# EAGLE schematic motorController-merged (EAGLE 9.3.0)

## Sheet 1 of 3
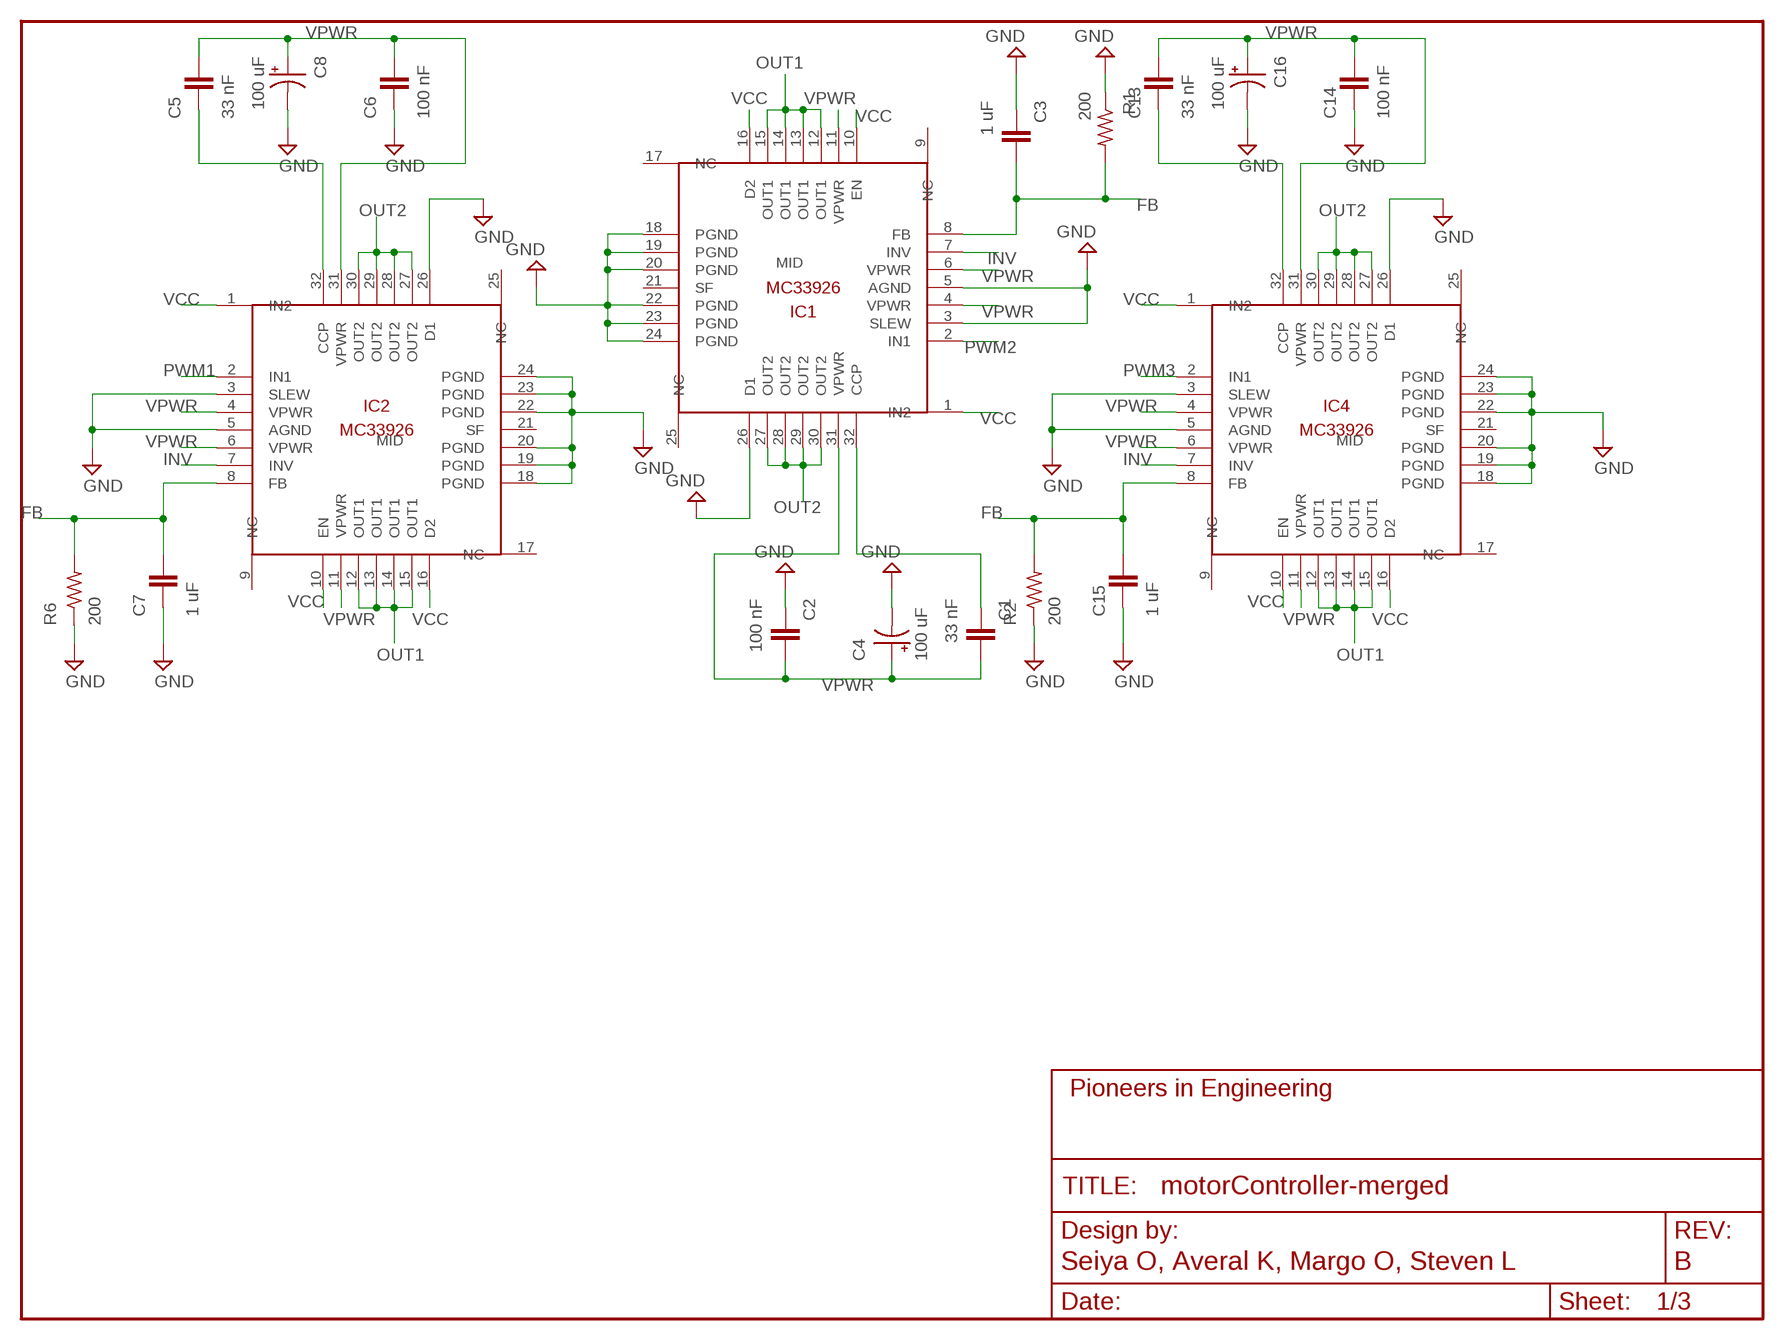
[diagram p0: schematic, sheet 1]
FRAME2 (FRAME_SCHEMATIC): AUTHOR: Seiya O, Averal K, Margo O, Steven L; REVISION: B

### Parts
C1  33 nF  CAP0603-CAP  [0603-CAP]
C2  100 nF  CAP0603-CAP  [0603-CAP]
C3  1 uF  CAP0603-CAP  [0603-CAP]
C4  100 uF  CAP_POLRADIAL  [.248"CAP_THRU]
C5  33 nF  CAP0603-CAP  [0603-CAP]
C6  100 nF  CAP0603-CAP  [0603-CAP]
C7  1 uF  CAP0603-CAP  [0603-CAP]
C8  100 uF  CAP_POLRADIAL  [.248"CAP_THRU]
C13  33 nF  CAP0603-CAP  [0603-CAP]
C14  100 nF  CAP0603-CAP  [0603-CAP]
C15  1 uF  CAP0603-CAP  [0603-CAP]
C16  100 uF  CAP_POLRADIAL  [.248"CAP_THRU]
IC1  MC33926  [PQFN-32]
IC2  MC33926  [PQFN-32]
IC4  MC33926  [PQFN-32]
R1  200  R-US_R0603  [R0603]
R2  200  R-US_R0603  [R0603]
R6  200  R-US_R0603  [R0603]

### Nets
CCP1: C5.1 IC2.32(CCP)
CCP3: C1.1 IC1.32(CCP)
CCP4: C13.1 IC4.32(CCP)
FB: C3.2 C7.2 C15.2 IC1.8(FB) IC2.8(FB) IC4.8(FB) R1.2 R2.2 R6.2 ; also sheet 2,3
GND: C2.1 C3.1 C4.MINUS(-) C6.1 C7.1 C8.MINUS(-) C14.1 C15.1 C16.MINUS(-) IC1.3(SLEW) IC1.5(AGND) IC1.18(PGND) IC1.19(PGND) IC1.20(PGND) IC1.22(PGND) IC1.23(PGND) IC1.24(PGND) IC1.26(D1) IC2.3(SLEW) IC2.5(AGND) IC2.18(PGND) IC2.19(PGND) IC2.20(PGND) IC2.22(PGND) IC2.23(PGND) IC2.24(PGND) IC2.26(D1) IC4.3(SLEW) IC4.5(AGND) IC4.18(PGND) IC4.19(PGND) IC4.20(PGND) IC4.22(PGND) IC4.23(PGND) IC4.24(PGND) IC4.26(D1) R1.1 R2.1 R6.1 ; also sheet 2,3
INV: IC1.7(INV) IC2.7(INV) IC4.7(INV) ; also sheet 2,3
OUT1: IC1.12(OUT1) IC1.13(OUT1) IC1.14(OUT1) IC1.15(OUT1) IC2.12(OUT1) IC2.13(OUT1) IC2.14(OUT1) IC2.15(OUT1) IC4.12(OUT1) IC4.13(OUT1) IC4.14(OUT1) IC4.15(OUT1) ; also sheet 2,3
OUT2: IC1.27(OUT2) IC1.28(OUT2) IC1.29(OUT2) IC1.30(OUT2) IC2.27(OUT2) IC2.28(OUT2) IC2.29(OUT2) IC2.30(OUT2) IC4.27(OUT2) IC4.28(OUT2) IC4.29(OUT2) IC4.30(OUT2) ; also sheet 2,3
PWM1: IC2.2(IN1) ; also sheet 3
PWM2: IC1.2(IN1) ; also sheet 3
PWM3: IC4.2(IN1) ; also sheet 3
VCC: IC1.1(IN2) IC1.10(EN) IC1.16(D2) IC2.1(IN2) IC2.10(EN) IC2.16(D2) IC4.1(IN2) IC4.10(EN) IC4.16(D2) ; also sheet 2,3
VPWR: C1.2 C2.2 C4.PLUS(+) C5.2 C6.2 C8.PLUS(+) C13.2 C14.2 C16.PLUS(+) IC1.4(VPWR) IC1.6(VPWR) IC1.11(VPWR) IC1.31(VPWR) IC2.4(VPWR) IC2.6(VPWR) IC2.11(VPWR) IC2.31(VPWR) IC4.4(VPWR) IC4.6(VPWR) IC4.11(VPWR) IC4.31(VPWR) ; also sheet 2,3
Unconnected: IC1.9(NC) IC1.17(NC) IC1.21(SF) IC1.25(NC) IC1.MID(AGND) IC2.9(NC) IC2.17(NC) IC2.21(SF) IC2.25(NC) IC2.MID(AGND) IC4.9(NC) IC4.17(NC) IC4.21(SF) IC4.25(NC) IC4.MID(AGND)

## Sheet 2 of 3
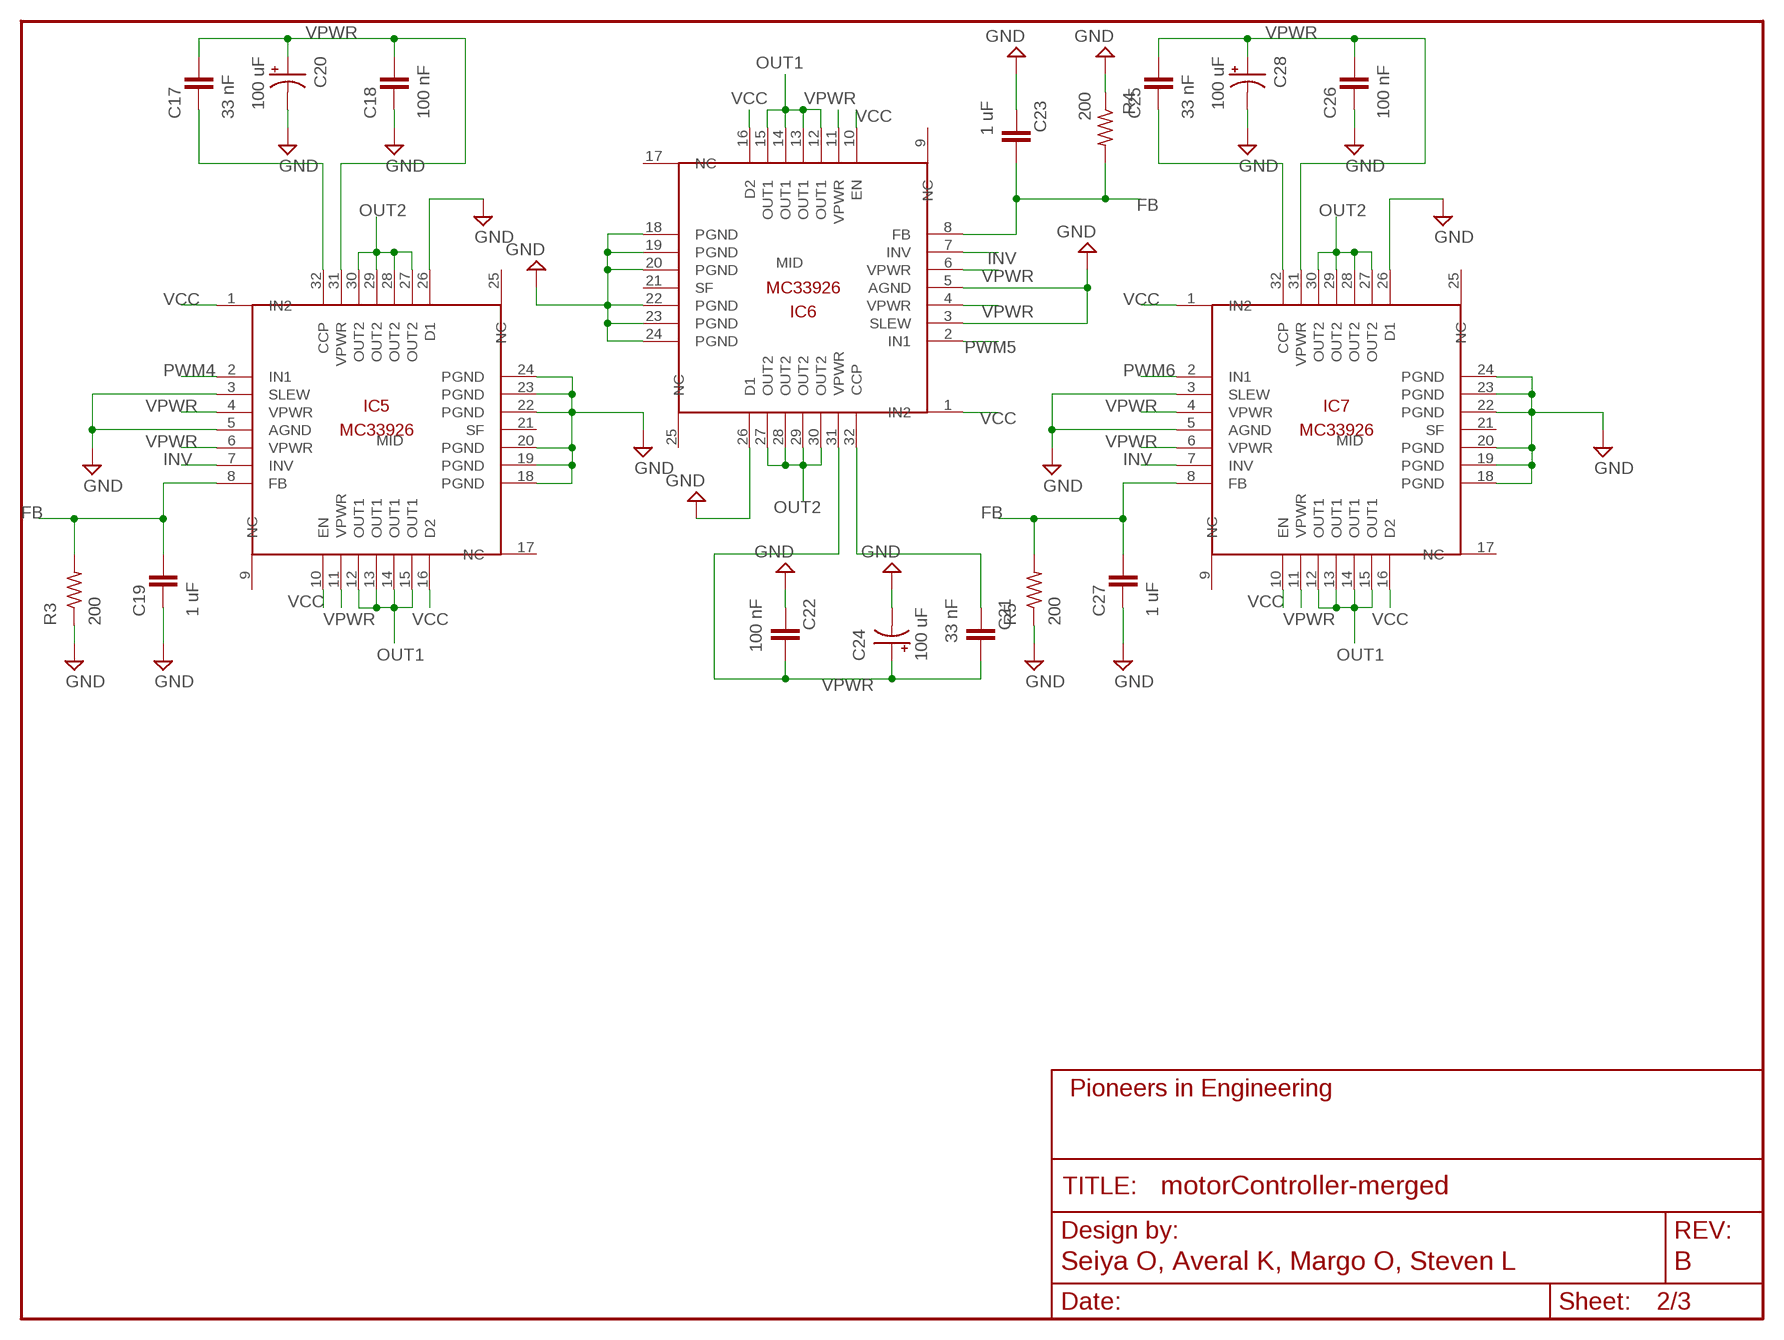
[diagram p1: schematic, sheet 2]
FRAME1 (FRAME_SCHEMATIC): AUTHOR: Seiya O, Averal K, Margo O, Steven L; REVISION: B

### Parts
C17  33 nF  CAP0603-CAP  [0603-CAP]
C18  100 nF  CAP0603-CAP  [0603-CAP]
C19  1 uF  CAP0603-CAP  [0603-CAP]
C20  100 uF  CAP_POLRADIAL  [.248"CAP_THRU]
C21  33 nF  CAP0603-CAP  [0603-CAP]
C22  100 nF  CAP0603-CAP  [0603-CAP]
C23  1 uF  CAP0603-CAP  [0603-CAP]
C24  100 uF  CAP_POLRADIAL  [.248"CAP_THRU]
C25  33 nF  CAP0603-CAP  [0603-CAP]
C26  100 nF  CAP0603-CAP  [0603-CAP]
C27  1 uF  CAP0603-CAP  [0603-CAP]
C28  100 uF  CAP_POLRADIAL  [.248"CAP_THRU]
IC5  MC33926  [PQFN-32]
IC6  MC33926  [PQFN-32]
IC7  MC33926  [PQFN-32]
R3  200  R-US_R0603  [R0603]
R4  200  R-US_R0603  [R0603]
R5  200  R-US_R0603  [R0603]

### Nets
CCP5: C17.1 IC5.32(CCP)
CCP6: C21.1 IC6.32(CCP)
CCP7: C25.1 IC7.32(CCP)
FB: C19.2 C23.2 C27.2 IC5.8(FB) IC6.8(FB) IC7.8(FB) R3.2 R4.2 R5.2 ; also sheet 1,3
GND: C18.1 C19.1 C20.MINUS(-) C22.1 C23.1 C24.MINUS(-) C26.1 C27.1 C28.MINUS(-) IC5.3(SLEW) IC5.5(AGND) IC5.18(PGND) IC5.19(PGND) IC5.20(PGND) IC5.22(PGND) IC5.23(PGND) IC5.24(PGND) IC5.26(D1) IC6.3(SLEW) IC6.5(AGND) IC6.18(PGND) IC6.19(PGND) IC6.20(PGND) IC6.22(PGND) IC6.23(PGND) IC6.24(PGND) IC6.26(D1) IC7.3(SLEW) IC7.5(AGND) IC7.18(PGND) IC7.19(PGND) IC7.20(PGND) IC7.22(PGND) IC7.23(PGND) IC7.24(PGND) IC7.26(D1) R3.1 R4.1 R5.1 ; also sheet 1,3
INV: IC5.7(INV) IC6.7(INV) IC7.7(INV) ; also sheet 1,3
OUT1: IC5.12(OUT1) IC5.13(OUT1) IC5.14(OUT1) IC5.15(OUT1) IC6.12(OUT1) IC6.13(OUT1) IC6.14(OUT1) IC6.15(OUT1) IC7.12(OUT1) IC7.13(OUT1) IC7.14(OUT1) IC7.15(OUT1) ; also sheet 1,3
OUT2: IC5.27(OUT2) IC5.28(OUT2) IC5.29(OUT2) IC5.30(OUT2) IC6.27(OUT2) IC6.28(OUT2) IC6.29(OUT2) IC6.30(OUT2) IC7.27(OUT2) IC7.28(OUT2) IC7.29(OUT2) IC7.30(OUT2) ; also sheet 1,3
PWM4: IC5.2(IN1) ; also sheet 3
PWM5: IC6.2(IN1) ; also sheet 3
PWM6: IC7.2(IN1) ; also sheet 3
VCC: IC5.1(IN2) IC5.10(EN) IC5.16(D2) IC6.1(IN2) IC6.10(EN) IC6.16(D2) IC7.1(IN2) IC7.10(EN) IC7.16(D2) ; also sheet 1,3
VPWR: C17.2 C18.2 C20.PLUS(+) C21.2 C22.2 C24.PLUS(+) C25.2 C26.2 C28.PLUS(+) IC5.4(VPWR) IC5.6(VPWR) IC5.11(VPWR) IC5.31(VPWR) IC6.4(VPWR) IC6.6(VPWR) IC6.11(VPWR) IC6.31(VPWR) IC7.4(VPWR) IC7.6(VPWR) IC7.11(VPWR) IC7.31(VPWR) ; also sheet 1,3
Unconnected: IC5.9(NC) IC5.17(NC) IC5.21(SF) IC5.25(NC) IC5.MID(AGND) IC6.9(NC) IC6.17(NC) IC6.21(SF) IC6.25(NC) IC6.MID(AGND) IC7.9(NC) IC7.17(NC) IC7.21(SF) IC7.25(NC) IC7.MID(AGND)

## Sheet 3 of 3
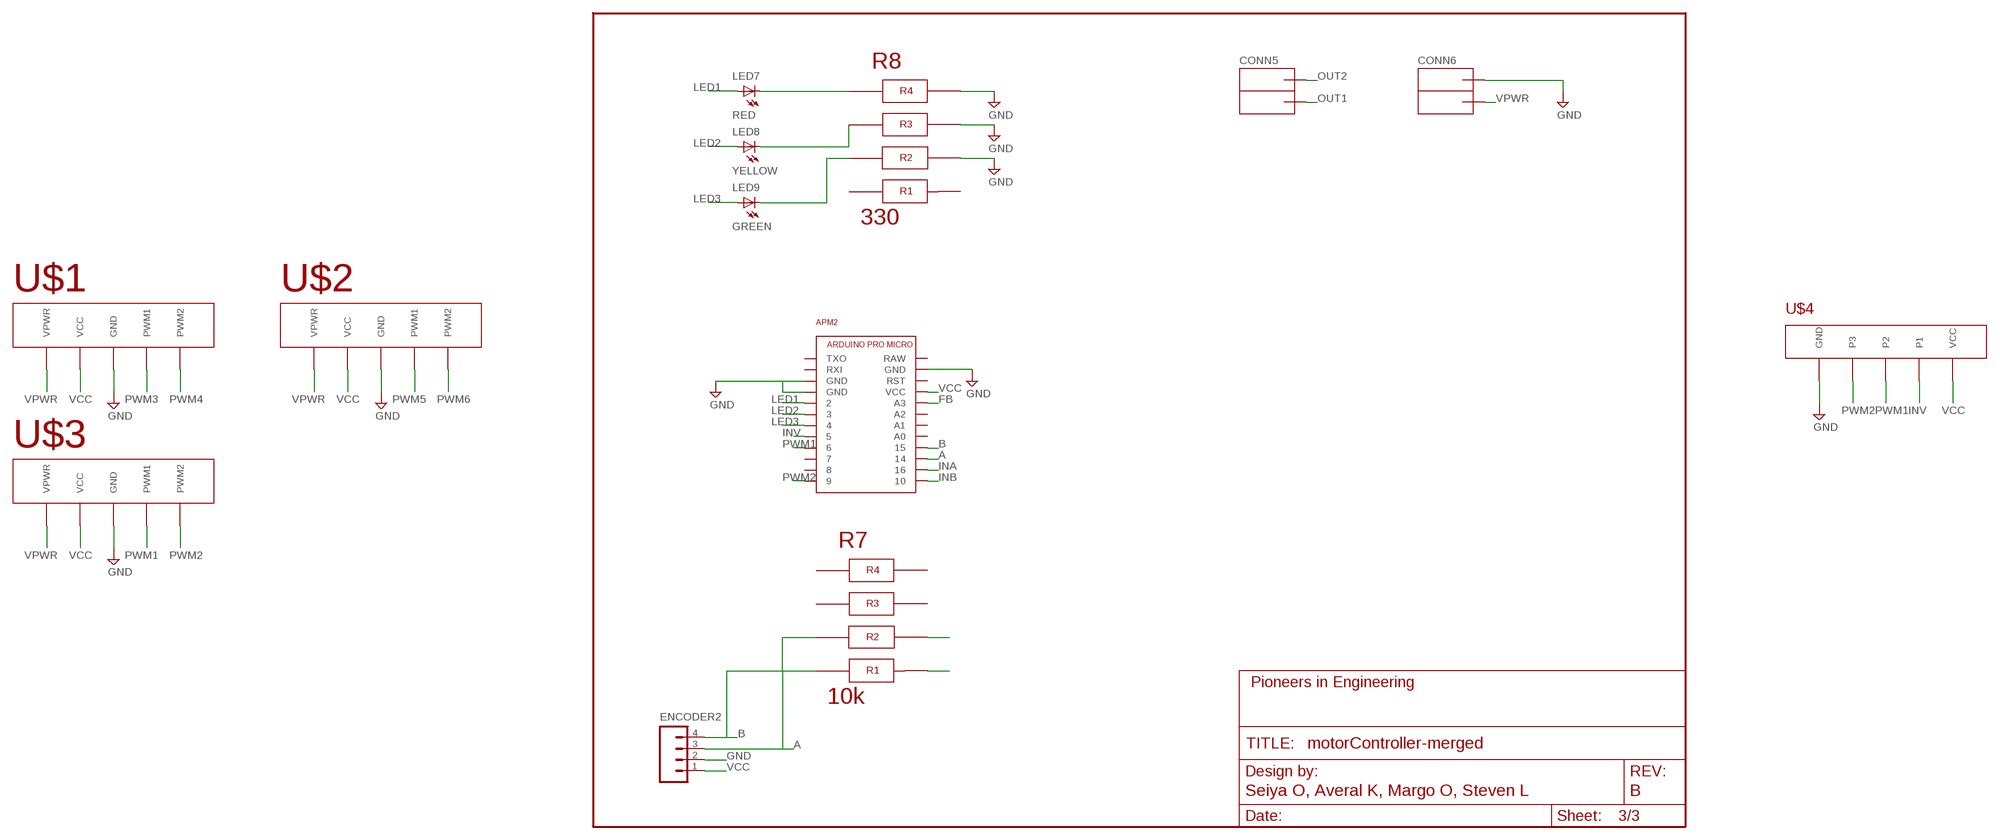
[diagram p2: schematic, sheet 3]
FRAME3 (FRAME_SCHEMATIC): AUTHOR: Seiya O, Averal K, Margo O, Steven L; REVISION: B

### Parts
APM2  ARDUINO_PRO_MICRO  [ARDUINO_PRO_MICRO]
CONN5  ANDERSONVERTICAL  [ANDERSON_VERTICAL]
CONN6  ANDERSONVERTICAL  [ANDERSON_VERTICAL]
ENCODER2  M041X04-MTA  [1X04-MTA]
LED7  RED  LED1206  [LED-1206]
LED8  YELLOW  LED1206  [LED-1206]
LED9  GREEN  LED1206  [LED-1206]
R7  10k  4X-0603  [4X-0603]
R8  330  4X-0603  [4X-0603]
U$1  5XPOGO  [5XPOGO.40"]
U$2  5XPOGO  [5XPOGO.40"]
U$3  5XPOGO  [5XPOGO.40"]
U$4  5PIN5PIN_MC  [5PIN_MC]

### Nets
A: APM2.14 ENCODER2.3 R7.7
B: APM2.15 ENCODER2.4 R7.8
FB: APM2.A3 ; also sheet 1,2
GND: APM2.GND@0(GND) APM2.GND@1(GND) APM2.GND@2(GND) CONN6.PIN2(OUTA) ENCODER2.2 R8.2 R8.3 R8.4 U$1.GND U$2.GND U$3.GND U$4.GND ; also sheet 1,2
INA: APM2.16
INB: APM2.10
INV: APM2.5 U$4.INV(P1) ; also sheet 1,2
LED1: APM2.2 LED7.A
LED2: APM2.3 LED8.A
LED3: APM2.4 LED9.A
N$7: LED7.C R8.5
N$8: LED9.C R8.7
N$9: LED8.C R8.6
OUT1: CONN5.PIN1(OUTB) ; also sheet 1,2
OUT2: CONN5.PIN2(OUTA) ; also sheet 1,2
PWM1: APM2.6 U$3.PWM1 U$4.PWM1(P2) ; also sheet 1
PWM2: APM2.9 U$3.PWM2 U$4.PWM2(P3) ; also sheet 1
PWM3: U$1.PWM1 ; also sheet 1
PWM4: U$1.PWM2 ; also sheet 2
PWM5: U$2.PWM1 ; also sheet 2
PWM6: U$2.PWM2 ; also sheet 2
VCC: APM2.VCC ENCODER2.1 R7.1 R7.2 U$1.VCC U$2.VCC U$3.VCC U$4.VCC ; also sheet 1,2
VPWR: CONN6.PIN1(OUTB) U$1.VPWR U$2.VPWR U$3.VPWR ; also sheet 1,2
Unconnected: APM2.7 APM2.8 APM2.A0 APM2.A1 APM2.A2 APM2.RAW APM2.RST APM2.RXI APM2.TXO R7.3 R7.4 R7.5 R7.6 R8.1 R8.8

## Library data of the parts
APM2 = pie:ARDUINO_PRO_MICRO: Arduino Pro Micro Electrical System Year 9's Smart Sensor Core Pin Outs <https://cdn.sparkfun.com/assets/9/c/3/c/4/523a1765757b7f5c6e8b4567.png> Buy Here <http://www.aliexpress.com/item/Mini-Leonardo-Pro-Micro-ATmega32U4-5V-16MHz-Module-For-Arduino-Best-Quality/32284746884.html?ws_ab_test=searchweb201556_8,searchweb201602_2_10057_10056_10065_10055_10054_10067_10069_10059_10058_10017_10070_10060_10061_10052_10062_10053_10050_10051,searchweb201603_1&btsid=45993952-29ca-4de4-a0fb-c7fb72b8e1a5> Thru Hole Female Pins <http://www.digikey.com/product-search/en?keywords=929974E-01-12-ND> Surface Mount Female Pins <http://www.digikey.com/product-detail/en/sullins-connector-solutions/NPTC121KFXC-RC/S5604-ND/776062>; DESCRIPTION: Arduino Pro Micro; DISTRIBUTOR: AliExpress; DISTRIBUTOR_PART_NUMBER: 32284746884; MANUFACTURER: Feiyang electronics; NOTES: https://www.aliexpress.com/item/Mini-Leonardo-Pro-Micro-ATmega32U4-5V-16MHz-Module-For-Arduino-Best-Quality/32284746884.html?ws_ab_test=searchweb201556_8,searchweb201602_2_10057_10056_10065_10055_10054_10067_10069_10059_10058_10017_10070_10060_10061_10052_10062_10053_10050_10051,searchweb201603_1&btsid=45993952-29ca-4de4-a0fb-c7fb72b8e1a5; PACKAGE: ARDUINO_PRO_MICRO; REFERENCE_DEST: ARDUINO_PRO_MICRO
C1-C3 C5-C7 C13-C15 C17-C19 C21-C23 C25-C27 = pie:CAP: Capacitor Standard 0603 ceramic capacitor, and 0.1" leaded capacitor.; PIE-INT-REF-NUM: CAPACITOR-GENERIC
C4 C8 C16 C20 C24 C28 = pie:CAP_POL: Capacitor Polarized These are standard SMD and PTH capacitors. Normally 10uF, 47uF, and 100uF in electrolytic and tantalum varieties. Always verify the external diameter of the through hole cap, it varies with capacity, voltage, and manufacturer. The EIA devices should be standard.
CONN5 CONN6 = pie:ANDERSON: 2-pin 25A Anderson Connector http://www.alliedelec.com/images/products/datasheets/bm/ANDERSON_POWER_PRODUCTS/70162018.pdf; PIE-INT-REF-NUM: Anderson
ENCODER2 = pie:M04: 4-pin 0.1-inch header and MTA connector; PIE-INT-REF-NUM: MTA
IC1 IC2 IC4-IC7 = pie:MC33926: https://www.nxp.com/docs/en/data-sheet/MC33926.pdf
LED7-LED9 = pie:LED: LEDs Standard schematic elements and footprints for 5mm, 3mm, 1206, and 0603 sized LEDs. 5mm - Spark Fun Electronics SKU : COM-00529 (and others); PIE-INT-REF-NUM: LED
R1-R6 = pie:R-US_: RESISTOR, American symbol; DESCRIPTION: RESISTOR, American symbol; DISTRIBUTOR: DigiKey; MANUFACTURER: Rohm Semiconductor; NOTES: Cut Tape; PACKAGE: R0603; VALUE: >VALUE
R7 R8 = pie:4X-0603: 330: https://www.digikey.com/product-detail/en/panasonic-electronic-components/EXB-38V331JV/Y9331CT-ND/256586 10k: https://www.digikey.com/product-detail/en/panasonic-electronic-components/EXB-38V103JV/Y9103CT-ND/256604
U$1-U$3 = pie:5XPOGO
U$4 = pie:5PIN